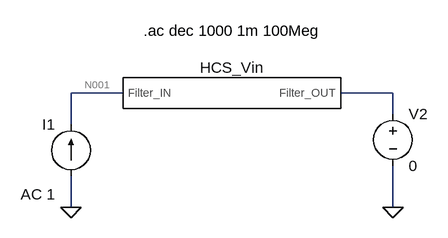
[diagram p0: schematic Draft1.asc]
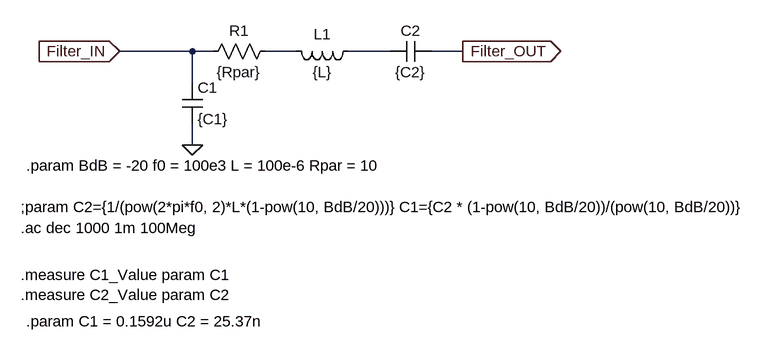
[diagram p1: sub-circuit filter_model.asc]
Draft1.asc, the LTspice schematic file:
Version 4
SHEET 1 880 680
WIRE 16 160 -64 160
WIRE 432 160 352 160
WIRE 432 192 432 160
WIRE -64 208 -64 160
WIRE -64 336 -64 288
WIRE 432 336 432 272
FLAG -64 336 0
FLAG 432 336 0
SYMBOL Filter_Model 176 160 R0
SYMATTR InstName HCS_Vin
SYMBOL voltage 432 176 R0
WINDOW 123 0 0 Left 0
WINDOW 39 0 0 Left 0
SYMATTR InstName V2
SYMATTR Value 0
SYMBOL current -64 288 R180
WINDOW 0 24 80 Left 2
WINDOW 3 24 0 Left 2
WINDOW 123 24 -28 Left 2
WINDOW 39 0 0 Left 0
SYMATTR InstName I1
SYMATTR Value ""
SYMATTR Value2 AC 1
TEXT 48 64 Left 2 !.ac dec 1000 1m 100Meg

filter_model.asc, the sub-circuit schematic file:
Version 4
SHEET 1 1212 680
WIRE 160 112 48 112
WIRE 192 112 160 112
WIRE 320 112 272 112
WIRE 464 112 400 112
WIRE 576 112 528 112
WIRE 160 160 160 112
WIRE 160 256 160 224
FLAG 160 256 0
FLAG 48 112 Filter_IN
IOPIN 48 112 In
FLAG 576 112 Filter_OUT
IOPIN 576 112 Out
SYMBOL cap 144 160 R0
SYMATTR InstName C1
SYMATTR Value {C1}
SYMBOL ind 416 96 R90
WINDOW 0 5 56 VBottom 2
WINDOW 3 32 56 VTop 2
SYMATTR InstName L1
SYMATTR Value {L}
SYMBOL cap 528 96 R90
WINDOW 0 0 32 VBottom 2
WINDOW 3 32 32 VTop 2
SYMATTR InstName C2
SYMATTR Value {C2}
SYMBOL res 288 96 R90
WINDOW 0 0 56 VBottom 2
WINDOW 3 32 56 VTop 2
SYMATTR InstName R1
SYMATTR Value {Rpar}
TEXT -104 352 Left 2 !;param C2={1/(pow(2*pi*f0, 2)*L*(1-pow(10, BdB/20)))} C1={C2 * (1-pow(10, BdB/20))/(pow(10, BdB/20))}
TEXT -104 384 Left 2 !.ac dec 1000 1m 100Meg
TEXT -96 288 Left 2 !.param BdB = -20 f0 = 100e3 L = 100e-6 Rpar = 10
TEXT -104 456 Left 2 !.measure C1_Value param C1\n.measure C2_Value param C2
TEXT -96 528 Left 2 !.param C1 = 0.1592u C2 = 25.37n

The netlist it stands for:
* Draft1.asc
XHCS_Vin N001 N002 filter_model
V2 N002 0 0
I1 0 N001 AC 1

* block symbol definitions
.subckt filter_model Filter_IN Filter_OUT
C1 Filter_IN 0 {C1}
L1 N002 N001 {L}
C2 Filter_OUT N002 {C2}
R1 N001 Filter_IN {Rpar}
;param C2={1/(pow(2*pi*f0, 2)*L*(1-pow(10, BdB/20)))} C1={C2 * (1-pow(10, BdB/20))/(pow(10, BdB/20))}
.ac dec 1000 1m 100Meg
.param BdB = -20 f0 = 100e3 L = 100e-6 Rpar = 10
.measure C1_Value param C1
.measure C2_Value param C2
.param C1 = 0.1592u C2 = 25.37n
.ends filter_model

.ac dec 1000 1m 100Meg
.backanno
.end

* Results of the author's LTspice run, read from the files saved beside the schematic
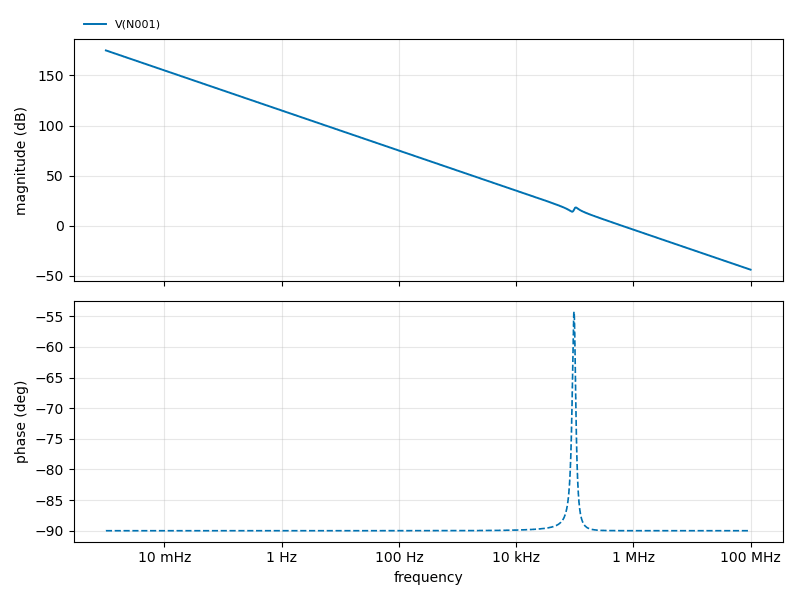
[diagram p2: AC Analysis of Draft1.asc, plotted from the saved traces]
* AC Analysis, 1 run:
*   V(N001): 175.05 dB at 1 mHz, -44.04 dB at 100 MHz, peak 175.05 dB at 1 mHz, 3 dB below the peak at 1.414 mHz